# Altium schematic sheet Thunder-Refix.SchDoc
size A3; DocumentNumber: 1; SheetNumber: 1; SheetTotal: 1
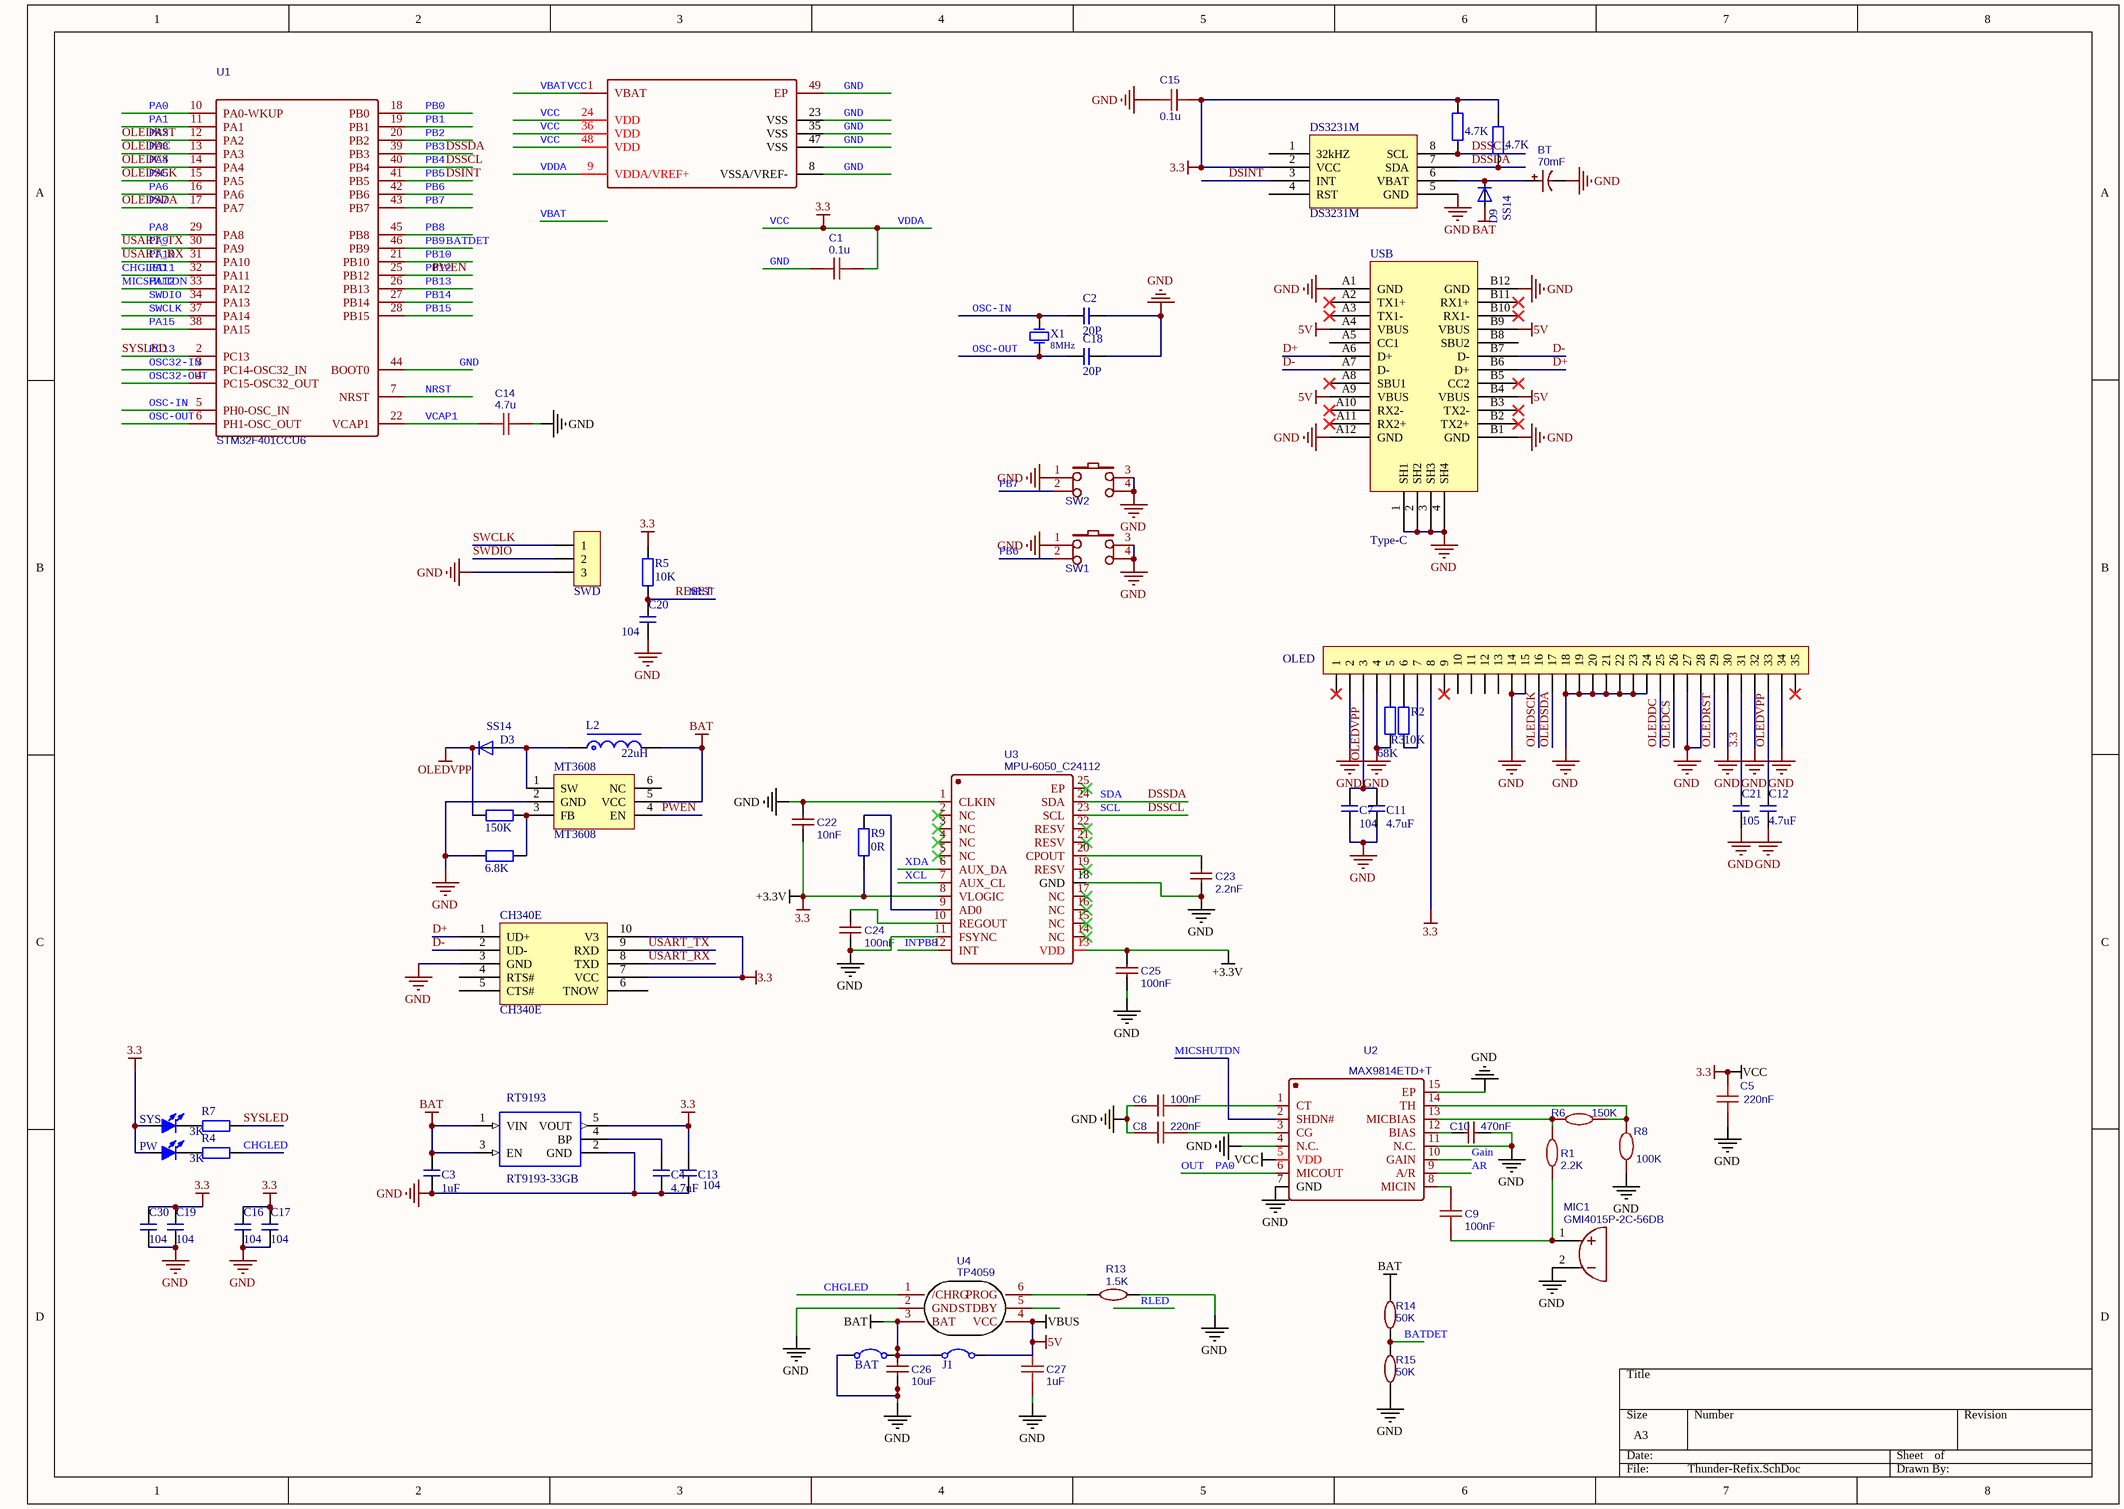
[diagram p0: Thunder-Refix.SchDoc]

## Parts
BAT  Jump  [jump1]  (value not drawn)
BT  70mF  [MS621FE-FL11E]
C1  0.1u  [0603C]
C2  20P  [0603C]
C3  1uF  [0603C]
C4  4.7uF  [0603C]
C5  220nF  [0603c]
C6  100nF  [0603c]
C7  104  [0603C]
C8  220nF  [0603c]
C9  100nF  [0603c]
C10  470nF  [0603c]
C11  4.7uF  [0603C]
C12  4.7uF  [0603C]
C13  104  [0603C]
C14  4.7u  [0603C]
C15  0.1u  [0603C]
C16  104  [0603C]
C17  104  [0603C]
C18  20P  [0603C]
C19  104  [0603C]
C20  104  [0603C]
C21  105  [0603C]
C22  10nF  [0603C]
C23  2.2nF  [0603C]
C24  100nF  [0603C]
C25  100nF  [0603C]
C26  10uF  [0603c]
C27  1uF  [0603c]
C30  104  [0603C]
CH340E  CH340E  [MSOP10_L]
D3  SS14  [SOD323_1N4148WS]
D9  SS14  [SOD323_1N4148WS]
DS3231M  DS3231M  [SOP8]
J1  Jump  [jump1]  (value not drawn)
L2  22uH  [1210-ec]
MIC1  GMI4015P-2C-56DB  [MIC-TH_BD4.0-P2.00-D0.4-L-FD]
MT3608  MT3608  [SOT23-6N]
OLED  FPC1.0-35P  [1.69 OLED]  (value not drawn)
PW  白色  [0603LED]  (value not drawn)
R1  2.2K  [0603r]
R2  10K  [0603R]
R3  68K  [0603R]
R4  3K  [0603R]
R5  10K  [0603R]
R6  150K  [0603r]
R7  3K  [0603R]
R8  100K  [0603r]
R9  0R  [0603R]
R10  4.7K  [0603R]
R11  4.7K  [0603R]
R13  1.5K  [0603r]
R14  50K  [0603r]
R15  50K  [0603r]
RB  150K  [0603R]
RS  6.8K  [0603R]
RT9193  RT9193-33GB  [sot23-5]
SW1  Button-SMD-4x4x1.5  [SW-SMD_TS-1086E-16]  (value not drawn)
SW2  Button-SMD-4x4x1.5  [SW-SMD_TS-1086E-16]  (value not drawn)
SWD  HDR-1X3  [ZH1.5-LI-3P]  (value not drawn)
SYS  粉色  [0603LED]  (value not drawn)
U1  STM32F401CCU6  [QFN48 7X7_N]
U2  MAX9814ETD+T  [TDFN-14_L3.0-W3.0-P0.40-BL-EP]
U3  MPU-6050_C24112  [QFN24 4x4_N]
U4  TP4059  [SOT23-6N]
USB  Type-C  [Type-C]
X1  value 8MHz  [OSC 5032-2P]  (hidden comment: 1.6.1.01.005.001)

## Nets
3.3: C1.1 C5.2 C13.2 C15.1 C16.1 C17.1 C19.1 C21.1 C22.1 C25.2 C30.1 CH340E.7(VCC) CH340E.10(V3) DS3231M.2(VCC) OLED.8 OLED.31 PW.1(A) R5.1 R9.1 R10.1 R11.1 RT9193.5(VOUT) SYS.1(A) U1.1(VBAT) U1.9(VDDA/VREF+) U1.24(VDD) U1.36(VDD) U1.48(VDD) U2.5(VDD) U3.8(VLOGIC) U3.13(VDD)  [also labelled +3.3V, VBAT, VCC, VDDA]
5V: C27.1 J1.2 U4.4(VCC) USB.A4(VBUS) USB.A9(VBUS) USB.B4(VBUS) USB.B9(VBUS)  [also labelled VBUS]
BAT: BAT.2 C3.2 C26.2 D9.A J1.1 L2.2 MT3608.5(VCC) R14.2 RT9193.1(VIN) RT9193.3(EN) U4.3(BAT)
GND: BAT.1 BT.2 C1.2 C2.1 C3.1 C4.1 C5.1 C6.1 C7.2 C8.1 C10.2 C11.2 C12.2 C13.1 C14.2 C15.2 C16.2 C17.2 C18.1 C19.2 C20.2 C21.2 C22.2 C23.1 C24.1 C25.1 C26.1 C27.2 C30.2 CH340E.3(GND) DS3231M.5(GND) MIC1.2 MT3608.2(GND) OLED.2 OLED.4 OLED.14 OLED.15 OLED.18 OLED.19 OLED.20 OLED.21 OLED.22 OLED.23 OLED.24 OLED.27 OLED.28 OLED.30 OLED.32 OLED.34 R3.1 R8.1 R13.2 R15.1 RS.1 RT9193.2(GND) SW1.1 SW1.3 SW1.4 SW2.1 SW2.3 SW2.4 SWD.3 U1.8(VSSA/VREF-) U1.23(VSS) U1.35(VSS) U1.44(BOOT0) U1.47(VSS) U1.49(EP) U2.4(N.C.) U2.7(GND) U2.11(N.C.) U2.15(EP) U3.1(CLKIN) U3.11(FSYNC) U3.18(GND) U4.2(GND) USB.1(SH1) USB.2(SH2) USB.3(SH3) USB.4(SH4) USB.A1(GND) USB.A12(GND) USB.B1(GND) USB.B12(GND)
OLEDVPP: C7.1 C11.1 C12.1 D3.C OLED.3 OLED.33 RB.1
AR: U2.9(A/R)
BATDET: R14.1 R15.2 U1.46(PB9)  [also labelled PB9]
CHGLED: R4.1 U1.32(PA11) U4.1(/CHRG)  [also labelled PA11]
D+: CH340E.1(UD+) USB.A6(D+) USB.B6(D+)
D-: CH340E.2(UD-) USB.A7(D-) USB.B7(D-)
DSINT: DS3231M.3(INT) U1.41(PB5)  [also labelled PB5]
DSSCL: DS3231M.8(SCL) R10.2 U1.40(PB4) U3.23(SCL)  [also labelled PB4, SCL]
DSSDA: DS3231M.7(SDA) R11.2 U1.39(PB3) U3.24(SDA)  [also labelled PB3, SDA]
Gain: U2.10(GAIN)
INT: U1.45(PB8) U3.12(INT)  [also labelled PB8]
MICSHUTDN: U1.33(PA12) U2.2(SHDN#)  [also labelled PA12]
NRST: C20.1 R5.2 U1.7(NRST)  [also labelled RESET]
OLEDCS: OLED.26 U1.14(PA4)  [also labelled PA4]
OLEDDC: OLED.25 U1.13(PA3)  [also labelled PA3]
OLEDRST: OLED.29 U1.12(PA2)  [also labelled PA2]
OLEDSCK: OLED.16 U1.15(PA5)  [also labelled PA5]
OLEDSDA: OLED.17 U1.17(PA7)  [also labelled PA7]
OSC32-IN: U1.3(PC14-OSC32_IN)
OSC32-OUT: U1.4(PC15-OSC32_OUT)
OSC-IN: C2.2 U1.5(PH0-OSC_IN) X1.1(OSC1)
OSC-OUT: C18.2 U1.6(PH1-OSC_OUT) X1.2(OSC2)
OUT: U1.10(PA0-WKUP) U2.6(MICOUT)  [also labelled PA0]
PA1: U1.11(PA1)
PA6: U1.16(PA6)
PA8: U1.29(PA8)
PA9: CH340E.9(RXD) U1.30(PA9)  [also labelled USART_TX]
PA10: CH340E.8(TXD) U1.31(PA10)  [also labelled USART_RX]
PA15: U1.38(PA15)
PB0: U1.18(PB0)
PB1: U1.19(PB1)
PB2: U1.20(PB2)
PB6: SW1.2 U1.42(PB6)
PB7: SW2.2 U1.43(PB7)
PB10: U1.21(PB10)
PB12: MT3608.4(EN) U1.25(PB12)  [also labelled PWEN]
PB13: U1.26(PB13)
PB14: U1.27(PB14)
PB15: U1.28(PB15)
PC13: R7.1 U1.2(PC13)  [also labelled SYSLED]
SWCLK: SWD.1 U1.37(PA14)
SWDIO: SWD.2 U1.34(PA13)
VCAP1: C14.1 U1.22(VCAP1)
XCL: U3.7(AUX_CL)
XDA: U3.6(AUX_DA)
NetBT_1: BT.1 D9.C DS3231M.6(VBAT)
NetC4_2: C4.2 RT9193.4(BP)
NetC6_2: C6.2 U2.1(CT)
NetC8_2: C8.2 U2.3(CG)
NetC9_1: C9.1 U2.8(MICIN)
NetC9_2: C9.2 MIC1.1 R1.1
NetC10_1: C10.1 U2.12(BIAS)
NetC23_2: C23.2 U3.20(CPOUT)
NetC24_2: C24.2 U3.10(REGOUT)
NetD3_A: D3.A L2.1 MT3608.1(SW)
NetMT3608_3: MT3608.3(FB) RB.2 RS.2
NetOLED_5: OLED.5 R3.2
NetOLED_6: OLED.6 R2.2
NetOLED_7: OLED.7 R2.1
NetPW_2: PW.2(K) R4.2
NetR1_2: R1.2 R6.1 U2.13(MICBIAS)
NetR6_2: R6.2 R8.2 U2.14(TH)
NetR7_2: R7.2 SYS.2(K)
NetR9_2: R9.2 U3.9(AD0)
NetR13_1: R13.1 U4.6(PROG)

Not connected (* = marked no-connect by the designer): CH340E 4(RTS#) 5(CTS#) 6(TNOW); DS3231M 1(32kHZ) 4(RST); MT3608 6(NC); OLED 1* 9* 10 11 12 13 35*; U3 2(NC)* 3(NC)* 4(NC)* 5(NC)* 14(NC)* 15(NC)* 16(NC)* 17(NC)* 19(RESV)* 21(RESV)* 22(RESV)* 25(EP)*; U4 5(STDBY); USB A2(TX1+)* A3(TX1-)* A5(CC1) A8(SBU1)* A10(RX2-)* A11(RX2+)* B2(TX2+)* B3(TX2-)* B5(CC2)* B8(SBU2) B10(RX1-)* B11(RX1+)*

## Library data of the parts
BAT J1 = Jump: 跳线; 版权归属: 源创客; BOM名称: 跳线; 学习资源: www.ooocke.com
BT = 70mF: BOM_Manufacturer: KORCHIP; BOM_Manufacturer Part: SM3R3703T01; nameAlias: Capacitance; Contributor: LCSC; BOM_Supplier: LCSC; BOM_Supplier Part: C132600; spicePre: C; spiceSymbolName: SM3R3703T01
C1 C15 = 0.1u: nameAlias: Value(F); Contributor: LCEDA_Lib; spicePre: C; spiceSymbolName: C_0402_US
C2-C4 C7 C11-C13 C16-C21 C30 = 电容
C5 C8 = 220nF: BOM_Manufacturer: Murata Electronics; BOM_Manufacturer Part: GCJ21BR71H224KA01L; nameAlias: Capacitance; Contributor: LCSC; BOM_Supplier: LCSC; BOM_Supplier Part: C354366; spicePre: C; spiceSymbolName: GCJ21BR71H224KA01L
C6 C9 = 100nF: BOM_Manufacturer: AVX; BOM_Manufacturer Part: FS055C104K4Z2A; nameAlias: Capacitance; Contributor: LCSC; BOM_Supplier: LCSC; BOM_Supplier Part: C444732; spicePre: C; spiceSymbolName: FS055C104K4Z2A
C10 = 470nF: BOM_Manufacturer Part: CL21B474KBFNNNE; BOM_Manufacturer: SAMSUNG; nameAlias: Capacitance; SMT Type: Basic; BOM_Supplier: LCSC; BOM_LCSC Assembly: Yes; BOM_Supplier Part: C13967; spicePre: C; spiceSymbolName: CL21B474KBFNNNE
C14 = 4.7u: nameAlias: Value(F); Contributor: LCEDA_Lib; spicePre: C; spiceSymbolName: C_0402_US
C22 = 10nF: BOM_Manufacturer: FH; BOM_Manufacturer Part: 0603B103K500NT; nameAlias: Capacitance; SMT Type: Basic; BOM_Supplier: LCSC; BOM_LCSC Assembly: Yes; BOM_Supplier Part: C57112; spicePre: C; spiceSymbolName: 0603B103K500NT
C23 = 2.2nF: BOM_Manufacturer: FH; BOM_Manufacturer Part: 0603B222K500NT; nameAlias: Capacitance; SMT Type: Basic; BOM_Supplier: LCSC; BOM_LCSC Assembly: Yes; BOM_Supplier Part: C1604; spicePre: C; spiceSymbolName: 0603B222K500NT
C24 C25 = 100nF: BOM_Manufacturer Part: CL05B104KO5NNNC; BOM_Manufacturer: SAMSUNG; nameAlias: Capacitance; SMT Type: Basic; BOM_Supplier: LCSC; BOM_LCSC Assembly: Yes; BOM_Supplier Part: C1525; spicePre: C; spiceSymbolName: CL05B104KO5NNNC
C26 = 10uF: BOM_Manufacturer: Murata Electronics; BOM_Manufacturer Part: GRM21BB31C106KE15L; nameAlias: Capacitance; Contributor: LCSC; BOM_Supplier: LCSC; BOM_Supplier Part: C162317; spicePre: C; spiceSymbolName: GRM21BB31C106KE15L
C27 = 1uF: BOM_Manufacturer: Taiyo Yuden; BOM_Manufacturer Part: UMK212BJ105KG-T; nameAlias: Capacitance; Contributor: LCSC; BOM_Supplier: LCSC; BOM_Supplier Part: C319195; spicePre: C; spiceSymbolName: UMK212BJ105KG-T
D3 D9 = 1N4148WS: Diode Switching 75V 0.3A 2-Pin SOD-323 T/R; MF: ON Semiconductor; SnapEDA_Link: https://www.snapeda.com/parts/1N4148WS/ON%20Semiconductor/view-part/?ref=snap; Price: None; Availability: Unavailable; MP: 1N4148WS; Package: S-0 Good-Ark; Value: *
L2 = L-CDRH: 功率屏蔽电感; 版权归属: 源创客; BOM名称: 功率屏蔽电感; 学习资源: www.ooocke.com
MIC1 = GMI4015P-2C-56DB: BOM_Manufacturer: INGHAi; Contributor: LCSC; BOM_Supplier: LCSC; BOM_Supplier Part: C233299; BOM_Manufacturer Part: GMI4015P-2C-56db; spicePre: M; spiceSymbolName: GMI4015P-2C-56DB
MT3608 = SX1308: 可调升压芯片; 版权归属: 源创客; BOM名称: 可调升压芯片; 学习资源: www.ooocke.com
OLED = FPC-35P: FPC连接器; 版权归属: 源创客; BOM名称: FPC连接器; 学习资源: www.ooocke.com
PW SYS = LED-F234: 方形LED; 版权归属: 源创客; BOM名称: 方形LED; 学习资源: www.ooocke.com
R1 = 2.2K: BOM_Manufacturer: Tyohm; BOM_Manufacturer Part: RMC08052.2K1%N; nameAlias: Resistance (Ohms); Contributor: LCSC; BOM_Supplier: LCSC; BOM_Supplier Part: C325769; spicePre: R; spiceSymbolName: RMC08052.2K1%N
R2-R5 R7 R9-R11 RB RS = R: 贴片电阻; 版权归属: 源创客; BOM名称: 贴片电阻; 学习资源: www.ooocke.com
R6 = 150K: BOM_Manufacturer: Tyohm; BOM_Manufacturer Part: RMC0805150K1%N; nameAlias: Resistance (Ohms); Contributor: LCSC; BOM_Supplier: LCSC; BOM_Supplier Part: C325765; spicePre: R; spiceSymbolName: RMC0805150K1%N
R8 = 100K: BOM_Manufacturer: Stackpole Elec; BOM_Manufacturer Part: RTAN0805BKE100K; nameAlias: Resistance (Ohms); Contributor: LCSC; SMT Type: Extend; BOM_Supplier: LCSC; BOM_Supplier Part: C346756; BOM_LCSC Assembly: Yes; spicePre: R; spiceSymbolName: RTAN0805BKE100K
R13-R15 = 1.5K: BOM_Manufacturer: YAGEO; BOM_Manufacturer Part: RC0603FR-071K5L; nameAlias: Resistance (Ohms); BOM_Supplier: LCSC; BOM_Supplier Part: C114668; spicePre: R; spiceSymbolName: RC0603FR-071K5L
RT9193 = RT9193-33GB: RT9193 Series 300 mA 3.3 V Ultra-Low Noise Ultra-Fast CMOS LDO Regulator-SC-70-5; MF: Richtek USA; SnapEDA_Link: https://www.snapeda.com/parts/RT9193-33GB/Richtek%20USA%20Inc./view-part/?ref=snap; Price: None; Availability: Unavailable; Package: SOT-23-5 Richtek; MP: RT9193-33GB; Value: *
SW1 SW2 = Button-SMD-4x4x1.5: BOM_Manufacturer: BBJ; BOM_Manufacturer Part: 4*4*1.5Copper head,260G, 0.25mm,; BOM_Supplier Part: C71830; BOM_Supplier: LCSC; spicePre: S; spiceSymbolName: Button-SMD-4x4x1.5
SWD = Header 3: 3P接插件; 版权归属: 源创客; BOM名称: 3P接插件; 学习资源: www.ooocke.com
U1 = STM32F401CCU6: BOM_Manufacturer: ST; subpart_no: 1; tags: STM32; BOM_Supplier Part: C79861; BOM_Supplier: LCSC; BOM_Manufacturer Part: STM32F401CCU6; spicePre: U; spiceSymbolName: STM32F401CCU6
U2 = MAX9814ETD+T: BOM_Manufacturer: MAXIM; BOM_Supplier: LCSC; BOM_Manufacturer Part: MAX9814ETD+T; image: //image.lceda.cn/szlcsc/C41714.jpg; BOM_Supplier Part: C41714; spicePre: U; spiceSymbolName: MAX9814ETD+T
U3 = MPU-6050_C24112: BOM_Manufacturer: InvenSense; sourceId: 1T5FDZYC8; SMT Type: Basic; timeStamp: 1462265206; BOM_Supplier: LCSC; BOM_Manufacturer Part: MPU-6050; BOM_LCSC Assembly: Yes; image: //image.lceda.cn/szlcsc/C24112.jpg; BOM_Supplier Part: C24112; spicePre: U; spiceSymbolName: MPU-6050_C24112
U4 = TP4059: BOM_Manufacturer: TOPPOWER; SMT Type: Extend; BOM_Supplier: LCSC; BOM_Manufacturer Part: TP4059; BOM_Supplier Part: C80364; BOM_LCSC Assembly: Yes; spicePre: U; spiceSymbolName: TP4059
X1 = 1.6.1.01.005.001: XTAL,8MHz,±20PPM,12.6*4.5; K3 No.: 1.6.1.01.005.001; GENERAL: *